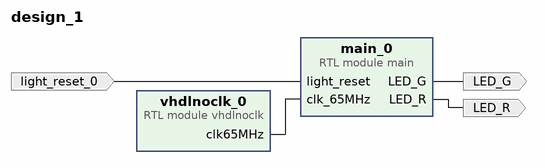
[diagram p0: block diagram of the top level]
# Vivado block design design_1, xc7z007sclg225-1, Vivado 2019.2
create_bd_design design_1

create_bd_port -dir O LED_G
create_bd_port -dir O LED_R
create_bd_port -dir I -type rst light_reset_0

create_bd_cell -type module -reference main main_0
create_bd_cell -type module -reference vhdlnoclk vhdlnoclk_0

# ---- connections ----

connect_bd_net [get_bd_pins main_0/LED_G] [get_bd_ports LED_G]
connect_bd_net [get_bd_pins main_0/LED_R] [get_bd_ports LED_R]
connect_bd_net -net light_reset_0_1 [get_bd_ports light_reset_0] [get_bd_pins main_0/light_reset]
connect_bd_net [get_bd_pins vhdlnoclk_0/clk65MHz] [get_bd_pins main_0/clk_65MHz]

validate_bd_design
save_bd_design
